# Altium schematic sheet 01_XDRONE.SchDoc: XDRONE
size A4; Author: Gabriel; Organization: Altium Limited; Address1: L3, 12a Rodborough Rd; Address2: Frenchs Forest; Address3: NSW; Address4: Australia 2086; Revision: v2.0; SheetNumber: 1; SheetTotal: 8; Subtitle: MAIN
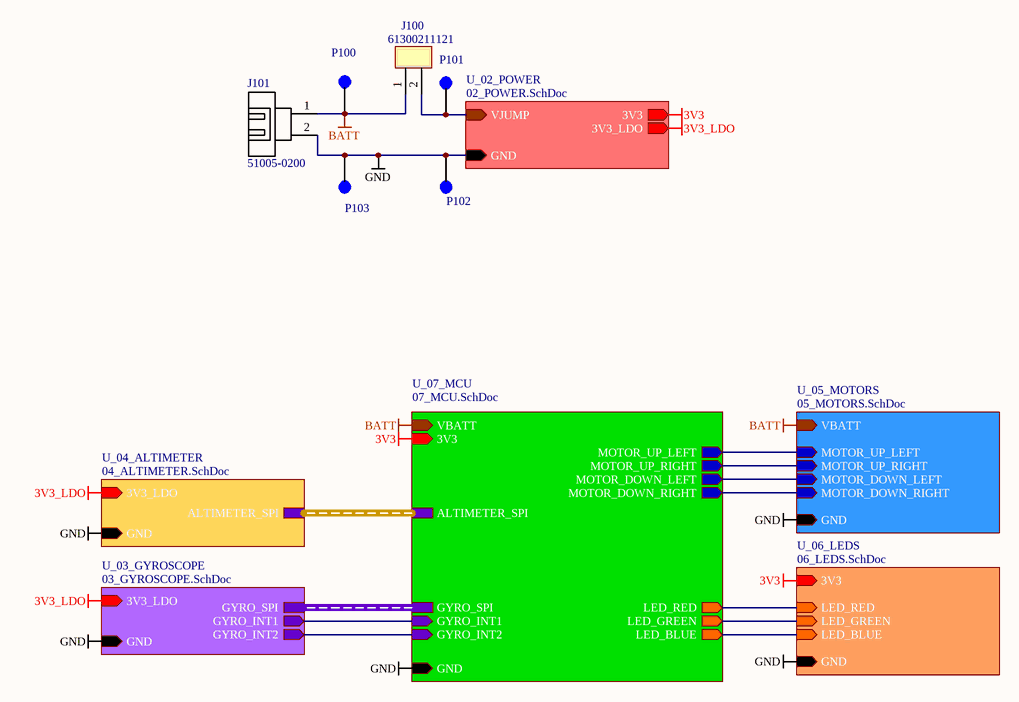
[diagram p0: 01_XDRONE.SchDoc]

## Parts
J100  MANUFACTURER REFERENCE: 61300211121  [CON_2x1PIN_RA_61300211121]  (hidden comment: CON_2x1PIN_ST_61300211121_2.54)
J101  MANUFACTURER REFERENCE: 51005-0200  [CON_2x1PIN_MOLEX_51005-0200]  (hidden comment: CON_2x1PIN_MALE_51005-0200)
P100  TEST_POINT_2mm  [TEST_POINT_2mm]  (value not drawn)
P101  TEST_POINT_2mm  [TEST_POINT_2mm]  (value not drawn)
P102  TEST_POINT_2mm  [TEST_POINT_2mm]  (value not drawn)
P103  TEST_POINT_2mm  [TEST_POINT_2mm]  (value not drawn)

## Sub-sheets
U_02_POWER = 02_POWER.SchDoc: GND (in), 3V3 (out), 3V3_LDO (out), VJUMP (in)
U_03_GYROSCOPE = 03_GYROSCOPE.SchDoc: GND (in), GYRO_INT1 (out), GYRO_INT2 (out), GYRO_SPI (harness GYRO_SPI), 3V3_LDO (in)
U_04_ALTIMETER = 04_ALTIMETER.SchDoc: GND (in), ALTIMETER_SPI (harness ALTIMETER_SPI), 3V3_LDO (in)
U_05_MOTORS = 05_MOTORS.SchDoc: GND (in), VBATT (in), MOTOR_UP_LEFT (in), MOTOR_UP_RIGHT (in), MOTOR_DOWN_LEFT (in), MOTOR_DOWN_RIGHT (in)
U_06_LEDS = 06_LEDS.SchDoc: LED_GREEN (in), LED_RED (in), LED_BLUE (in), GND (in), 3V3 (in)
U_07_MCU = 07_MCU.SchDoc: GND (in), 3V3 (in), ALTIMETER_SPI (harness ALTIMETER_SPI), GYRO_SPI (harness GYRO_SPI), MOTOR_UP_LEFT (out), MOTOR_UP_RIGHT (out), MOTOR_DOWN_LEFT (out), MOTOR_DOWN_RIGHT (out), VBATT (in), LED_RED (out), LED_GREEN (out), LED_BLUE (out), GYRO_INT1 (in), GYRO_INT2 (in)

## Nets
3V3: sheet U_07_MCU/3V3, sheet U_06_LEDS/3V3, sheet U_02_POWER/3V3
3V3_LDO: sheet U_04_ALTIMETER/3V3_LDO, sheet U_03_GYROSCOPE/3V3_LDO, sheet U_02_POWER/3V3_LDO
BATT: J100.1 J101.1(GND) P100.1 ; sheet U_07_MCU/VBATT, sheet U_05_MOTORS/VBATT
GND: J101.2(VBATT) P102.1 P103.1 ; sheet U_04_ALTIMETER/GND, sheet U_03_GYROSCOPE/GND, sheet U_07_MCU/GND, sheet U_06_LEDS/GND, sheet U_05_MOTORS/GND, sheet U_02_POWER/GND
NetJ100_2: J100.2 P101.1 ; sheet U_02_POWER/VJUMP
(unnamed): sheet U_03_GYROSCOPE/GYRO_INT1, sheet U_07_MCU/GYRO_INT1
(unnamed): sheet U_03_GYROSCOPE/GYRO_INT2, sheet U_07_MCU/GYRO_INT2
(unnamed): sheet U_07_MCU/MOTOR_UP_LEFT, sheet U_05_MOTORS/MOTOR_UP_LEFT
(unnamed): sheet U_07_MCU/MOTOR_UP_RIGHT, sheet U_05_MOTORS/MOTOR_UP_RIGHT
(unnamed): sheet U_07_MCU/MOTOR_DOWN_LEFT, sheet U_05_MOTORS/MOTOR_DOWN_LEFT
(unnamed): sheet U_07_MCU/MOTOR_DOWN_RIGHT, sheet U_05_MOTORS/MOTOR_DOWN_RIGHT
(unnamed): sheet U_07_MCU/LED_RED, sheet U_06_LEDS/LED_RED
(unnamed): sheet U_07_MCU/LED_GREEN, sheet U_06_LEDS/LED_GREEN
(unnamed): sheet U_07_MCU/LED_BLUE, sheet U_06_LEDS/LED_BLUE

## Buses and harness runs
harness sheet U_03_GYROSCOPE/GYRO_SPI = sheet U_07_MCU/GYRO_SPI
harness sheet U_04_ALTIMETER/ALTIMETER_SPI = sheet U_07_MCU/ALTIMETER_SPI

## Notes on the sheet
- TITLE:
- CREATED BY
- MODIFIED DATE
- REV
- PAGE
- /

## Library data of the parts
J100 = CON_2x1PIN_ST_61300211121_2.54: CONNECTOR 2x1 PIN ST 61300211121 WE 2.54 PITCH; CURRENT RATING: 3A; ANGLE: STRAIGHT; PITCH: 2.54 mm; GENDER: MALE; ROWS: 1; COLUMNS: 2; MANUFACTURER: WE; MOUNTING: THT
J101 = CON_2x1PIN_MALE_51005-0200: CONNECTOR 2x1PIN MALE 51005-0200; MANUFACTURER: MOLEX; ANGLE: STRAIGHT; ROWS: 2; COLUMNS: 1; MOUNTING: SMD; GENDER: MALE
P100-P103 = TEST_POINT_2mm: MOUNTING: SMD